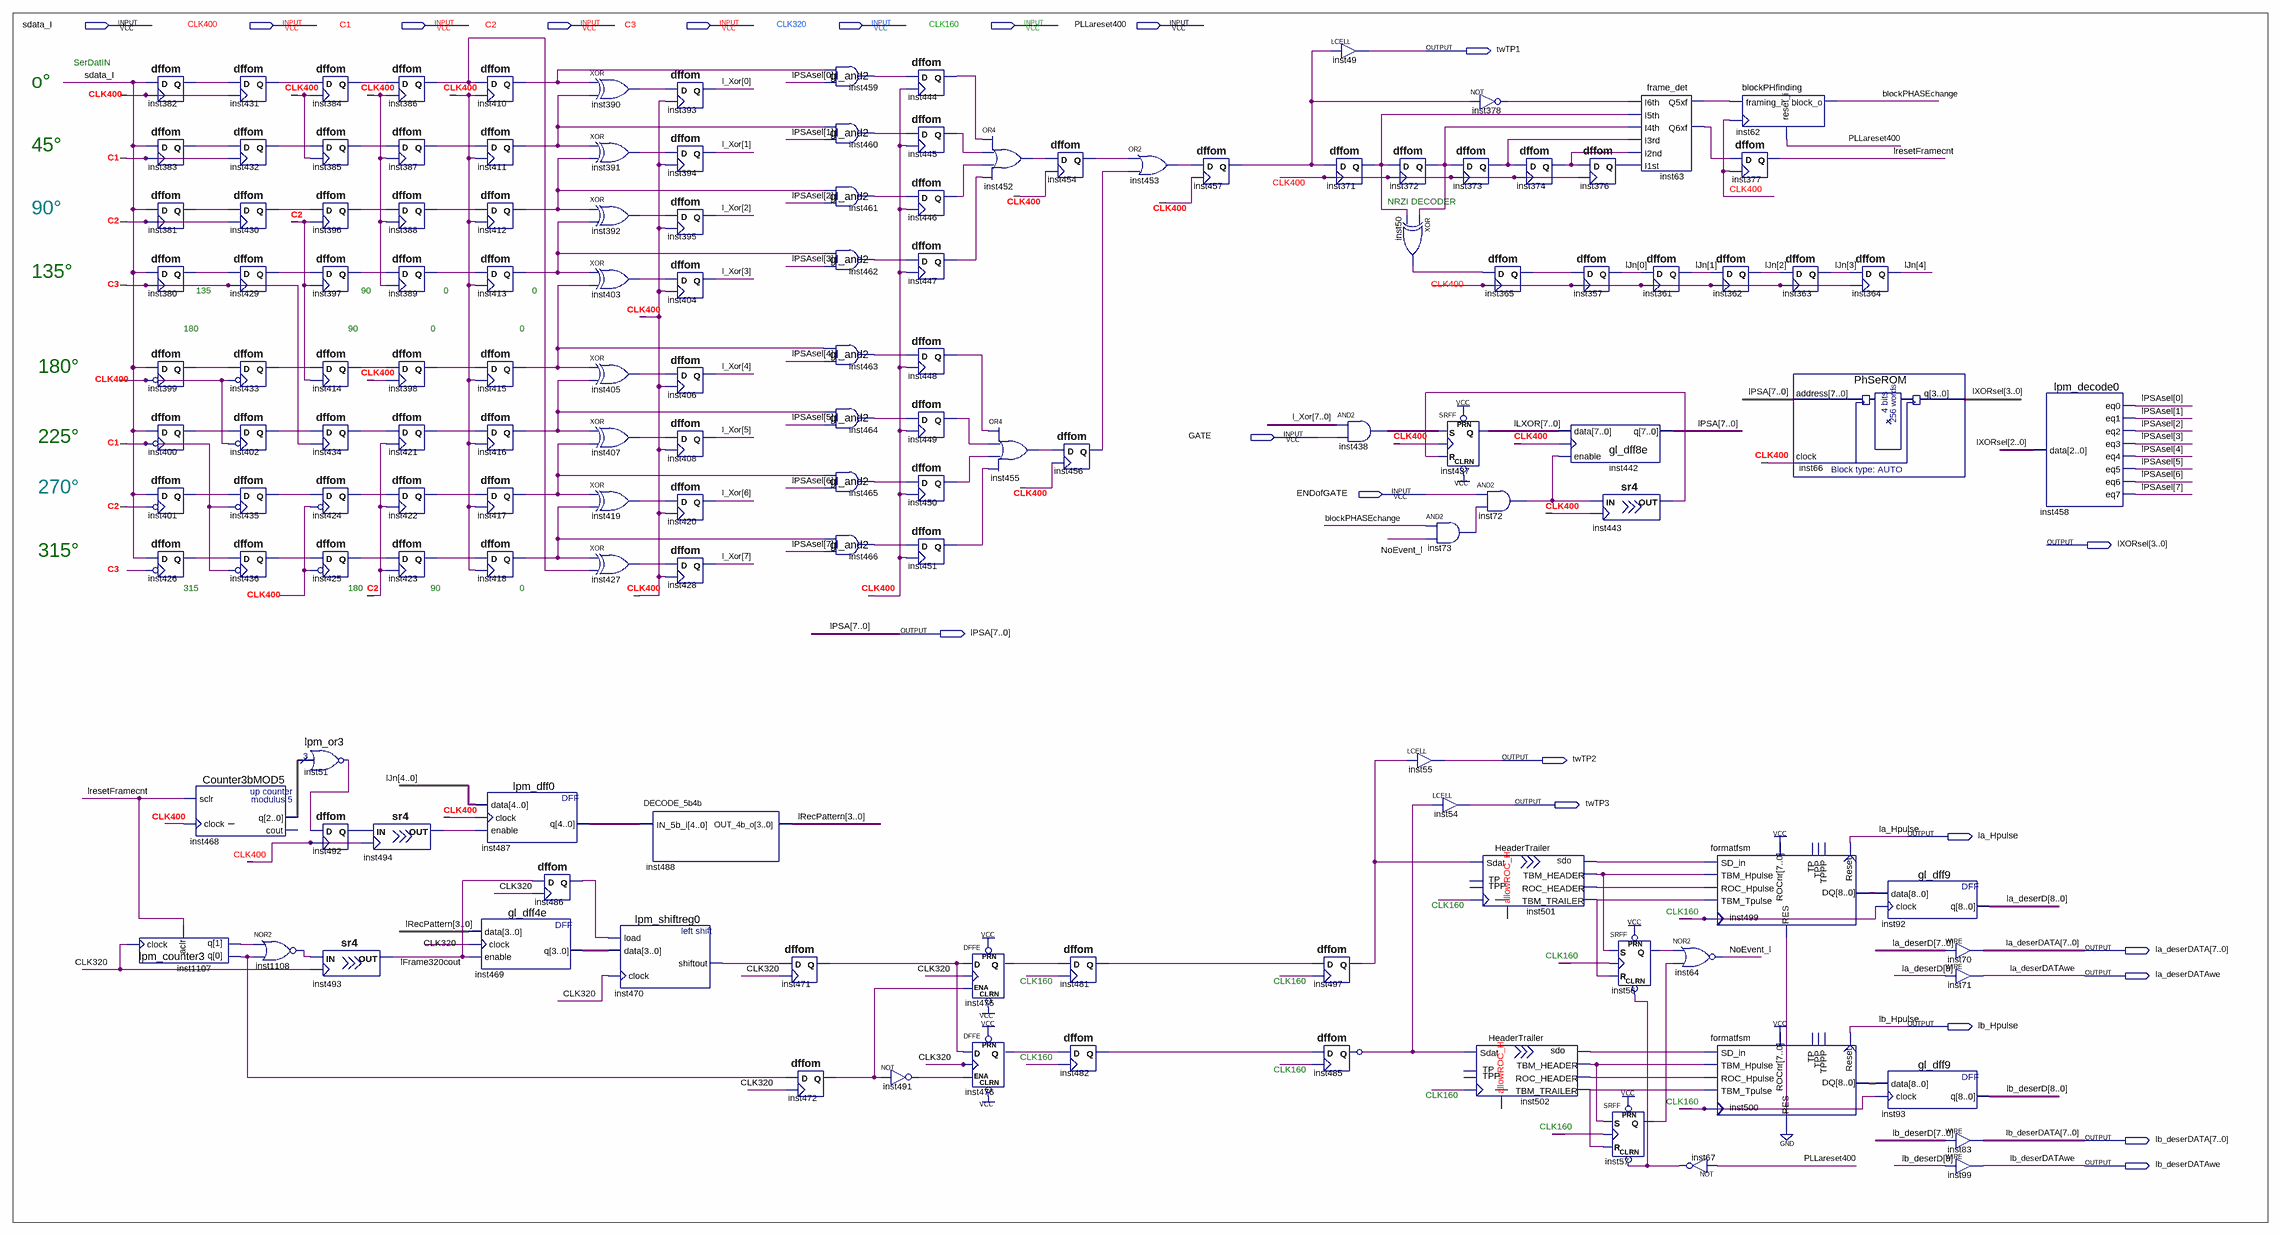
[diagram p0: schematic sheet]
// Quartus schematic deser400old.bdf as structural Verilog: 140 symbols, 21 pins
module deser400old (
  input  sdata_I,
  input  CLK400,
  input  C1,
  input  C2,
  input  C3,
  input  CLK320,
  input  CLK160,
  input  PLLareset400,
  input  GATE,
  input  ENDofGATE,
  output twTP1,
  output [3:0] lXORsel,
  output [7:0] lPSA,
  output twTP2,
  output twTP3,
  output la_Hpulse,
  output [7:0] la_deserDATA,
  output la_deserDATAwe,
  output lb_Hpulse,
  output [7:0] lb_deserDATA,
  output lb_deserDATAwe
);

  wire blockPHASEchange, inst50_out, inst51_result, inst51_result_inverted_out, inst56_q, inst57_q,
       inst63_q5xf, inst63_q6xf, inst67_out, inst72_out, inst73_out, inst365_q, inst371_q, inst372_q,
       inst373_q, inst374_q, inst376_q, inst378_out, inst380_q, inst381_q, inst382_q, inst383_q, inst384_q,
       inst385_q, inst386_q, inst387_q, inst388_q, inst389_q, inst390_out, inst391_out, inst392_out,
       inst396_q, inst397_q, inst398_q, inst399_q, inst400_q, inst401_q, inst402_q, inst403_out, inst405_out,
       inst407_out, inst410_q, inst411_q, inst412_q, inst413_q, inst414_q, inst415_q, inst416_q, inst417_q,
       inst418_q, inst419_out, inst421_q, inst422_q, inst423_q, inst424_q, inst425_q, inst426_q, inst427_out,
       inst429_q, inst430_q, inst431_q, inst432_q, inst433_q, inst434_q, inst435_q, inst436_q, inst443_out,
       inst444_q, inst445_q, inst446_q, inst447_q, inst448_q, inst449_q, inst450_q, inst451_q, inst452_out,
       inst453_out, inst454_q, inst455_out, inst456_q, inst457_q, inst459_result, inst460_result,
       inst461_result, inst462_result, inst463_result, inst464_result, inst465_result, inst466_result,
       inst470_shiftout, inst471_q, inst472_q, inst475_q, inst476_q, inst481_q, inst482_q, inst485_q,
       inst485_Q_inverted_out, inst486_q, inst491_out, inst492_q, inst494_out, inst497_q, inst501_roc_header,
       inst501_sdo, inst501_tbm_header, inst501_tbm_trailer, inst502_roc_header, inst502_sdo,
       inst502_tbm_header, inst502_tbm_trailer, inst1107_q, inst1107_q_2, inst1108_out, lFrame320cout,
       lresetFramecnt, NoEvent_l;
  wire [2:0] inst468_q;
  wire [3:0] inst469_q, lRecPattern;
  wire [4:0] inst487_q, lJn;
  wire [7:0] inst438_out, l_Xor, lLXOR, lPSAsel;
  wire [8:0] inst499_dq, inst500_dq, la_deserD, lb_deserD;

  dffom inst382 (.D(sdata_I), .CK(CLK400), .Q(inst382_q));
  dffom inst383 (.D(sdata_I), .CK(C1), .Q(inst383_q));
  dffom inst381 (.D(sdata_I), .CK(C2), .Q(inst381_q));
  dffom inst380 (.D(sdata_I), .CK(C3), .Q(inst380_q));
  dffom inst399 (.D(sdata_I), .CK(~CLK400), .Q(inst399_q));
  dffom inst400 (.D(sdata_I), .CK(~C1), .Q(inst400_q));
  dffom inst401 (.D(sdata_I), .CK(~C2), .Q(inst401_q));
  dffom inst426 (.D(sdata_I), .CK(~C3), .Q(inst426_q));
  lpm_counter3 inst1107 (.clock(CLK320), .aclr(lresetFramecnt), .q({inst1107_q, inst1107_q_2}));
  Counter3bMOD5 inst468 (.sclr(lresetFramecnt), .clock(CLK400), .q(inst468_q));  // open: cout
  dffom inst431 (.D(inst382_q), .CK(CLK400), .Q(inst431_q));
  dffom inst432 (.D(inst383_q), .CK(C1), .Q(inst432_q));
  dffom inst430 (.D(inst381_q), .CK(C2), .Q(inst430_q));
  dffom inst429 (.D(inst380_q), .CK(C3), .Q(inst429_q));
  dffom inst433 (.D(inst399_q), .CK(~CLK400), .Q(inst433_q));
  dffom inst402 (.D(inst400_q), .CK(~CLK400), .Q(inst402_q));
  dffom inst435 (.D(inst401_q), .CK(~C1), .Q(inst435_q));
  dffom inst436 (.D(inst426_q), .CK(~C1), .Q(inst436_q));
  nor inst1108 (inst1108_out, inst1107_q, inst1107_q_2);
  dffom inst384 (.D(inst431_q), .CK(CLK400), .Q(inst384_q));
  dffom inst385 (.D(inst432_q), .CK(CLK400), .Q(inst385_q));
  dffom inst396 (.D(inst430_q), .CK(C2), .Q(inst396_q));
  dffom inst397 (.D(inst429_q), .CK(C2), .Q(inst397_q));
  dffom inst414 (.D(inst433_q), .CK(C2), .Q(inst414_q));
  dffom inst434 (.D(inst402_q), .CK(C3), .Q(inst434_q));
  dffom inst424 (.D(inst435_q), .CK(~CLK400), .Q(inst424_q));
  dffom inst425 (.D(inst436_q), .CK(~CLK400), .Q(inst425_q));
  lpm_or3 inst51 (.data(inst468_q), .result(inst51_result));
  not inst51_result_inverted (inst51_result_inverted_out, inst51_result);
  dffom inst492 (.D(inst51_result_inverted_out), .CK(CLK400), .Q(inst492_q));
  sr4 inst493 (.IN(inst1108_out), .CLK(CLK320), .OUT(lFrame320cout));
  sr4 inst494 (.IN(inst492_q), .CLK(CLK400), .OUT(inst494_out));
  dffom inst386 (.D(inst384_q), .CK(CLK400), .Q(inst386_q));
  dffom inst387 (.D(inst385_q), .CK(CLK400), .Q(inst387_q));
  dffom inst388 (.D(inst396_q), .CK(CLK400), .Q(inst388_q));
  dffom inst389 (.D(inst397_q), .CK(CLK400), .Q(inst389_q));
  dffom inst398 (.D(inst414_q), .CK(CLK400), .Q(inst398_q));
  dffom inst421 (.D(inst434_q), .CK(C2), .Q(inst421_q));
  dffom inst422 (.D(inst424_q), .CK(C2), .Q(inst422_q));
  dffom inst423 (.D(inst425_q), .CK(C2), .Q(inst423_q));
  dffom inst410 (.D(inst386_q), .CK(CLK400), .Q(inst410_q));
  dffom inst411 (.D(inst387_q), .CK(CLK400), .Q(inst411_q));
  dffom inst412 (.D(inst388_q), .CK(CLK400), .Q(inst412_q));
  dffom inst413 (.D(inst389_q), .CK(CLK400), .Q(inst413_q));
  dffom inst415 (.D(inst398_q), .CK(CLK400), .Q(inst415_q));
  dffom inst416 (.D(inst421_q), .CK(CLK400), .Q(inst416_q));
  dffom inst417 (.D(inst422_q), .CK(CLK400), .Q(inst417_q));
  dffom inst418 (.D(inst423_q), .CK(CLK400), .Q(inst418_q));
  lpm_dff0 inst487 (.data(lJn), .clock(CLK400), .enable(inst494_out), .q(inst487_q));
  gl_dff4e inst469 (.data(lRecPattern), .clock(CLK320), .enable(lFrame320cout), .q(inst469_q));
  dffom inst486 (.D(lFrame320cout), .CK(CLK320), .Q(inst486_q));
  xor inst390 (inst390_out, inst410_q, inst411_q);
  xor inst391 (inst391_out, inst411_q, inst412_q);
  xor inst392 (inst392_out, inst412_q, inst413_q);
  xor inst403 (inst403_out, inst413_q, inst415_q);
  xor inst405 (inst405_out, inst415_q, inst416_q);
  xor inst407 (inst407_out, inst416_q, inst417_q);
  xor inst419 (inst419_out, inst417_q, inst418_q);
  xor inst427 (inst427_out, inst418_q, inst386_q);
  lpm_shiftreg0 inst470 (.load(inst486_q), .data(inst469_q), .clock(CLK320), .shiftout(inst470_shiftout));
  dffom inst393 (.D(inst390_out), .CK(CLK400), .Q(l_Xor[0]));
  dffom inst394 (.D(inst391_out), .CK(CLK400), .Q(l_Xor[1]));
  dffom inst395 (.D(inst392_out), .CK(CLK400), .Q(l_Xor[2]));
  dffom inst404 (.D(inst403_out), .CK(CLK400), .Q(l_Xor[3]));
  dffom inst406 (.D(inst405_out), .CK(CLK400), .Q(l_Xor[4]));
  dffom inst408 (.D(inst407_out), .CK(CLK400), .Q(l_Xor[5]));
  dffom inst420 (.D(inst419_out), .CK(CLK400), .Q(l_Xor[6]));
  dffom inst428 (.D(inst427_out), .CK(CLK400), .Q(l_Xor[7]));
  DECODE_5b4b inst488 (.IN_5b_i(inst487_q), .OUT_4b_o(lRecPattern));
  dffom inst471 (.D(inst470_shiftout), .CK(CLK320), .Q(inst471_q));
  dffom inst472 (.D(inst1107_q_2), .CK(CLK320), .Q(inst472_q));
  gl_and2 inst459 (.data0(inst410_q), .data1(lPSAsel[0]), .result(inst459_result));
  gl_and2 inst460 (.data0(inst411_q), .data1(lPSAsel[1]), .result(inst460_result));
  gl_and2 inst461 (.data0(inst412_q), .data1(lPSAsel[2]), .result(inst461_result));
  gl_and2 inst462 (.data0(inst413_q), .data1(lPSAsel[3]), .result(inst462_result));
  gl_and2 inst463 (.data0(inst415_q), .data1(lPSAsel[4]), .result(inst463_result));
  gl_and2 inst464 (.data0(inst416_q), .data1(lPSAsel[5]), .result(inst464_result));
  gl_and2 inst465 (.data0(inst417_q), .data1(lPSAsel[6]), .result(inst465_result));
  gl_and2 inst466 (.data0(inst418_q), .data1(lPSAsel[7]), .result(inst466_result));
  dffom inst444 (.D(inst459_result), .CK(CLK400), .Q(inst444_q));
  dffom inst445 (.D(inst460_result), .CK(CLK400), .Q(inst445_q));
  dffom inst446 (.D(inst461_result), .CK(CLK400), .Q(inst446_q));
  dffom inst447 (.D(inst462_result), .CK(CLK400), .Q(inst447_q));
  dffom inst448 (.D(inst463_result), .CK(CLK400), .Q(inst448_q));
  dffom inst449 (.D(inst464_result), .CK(CLK400), .Q(inst449_q));
  dffom inst450 (.D(inst465_result), .CK(CLK400), .Q(inst450_q));
  dffom inst451 (.D(inst466_result), .CK(CLK400), .Q(inst451_q));
  not inst491 (inst491_out, inst472_q);
  DFFE inst475 (.PRN(1'b1), .CLRN(1'b1), .D(inst471_q), .CLK(CLK320), .ENA(inst472_q), .Q(inst475_q));
  DFFE inst476 (.PRN(1'b1), .CLRN(1'b1), .D(inst471_q), .CLK(CLK320), .ENA(inst491_out), .Q(inst476_q));
  or inst452 (inst452_out, inst444_q, inst445_q, inst446_q, inst447_q);
  or inst455 (inst455_out, inst448_q, inst449_q, inst450_q, inst451_q);
  dffom inst454 (.D(inst452_out), .CK(CLK400), .Q(inst454_q));
  dffom inst456 (.D(inst455_out), .CK(CLK400), .Q(inst456_q));
  dffom inst481 (.D(inst475_q), .CK(CLK160), .Q(inst481_q));
  dffom inst482 (.D(inst476_q), .CK(CLK160), .Q(inst482_q));
  or inst453 (inst453_out, inst454_q, inst456_q);
  dffom inst457 (.D(inst453_out), .CK(CLK400), .Q(inst457_q));
  dffom inst371 (.D(inst457_q), .CK(CLK400), .Q(inst371_q));
  dffom inst497 (.D(inst481_q), .CK(CLK160), .Q(inst497_q));
  dffom inst485 (.D(inst482_q), .CK(CLK160), .Q(inst485_q));
  not inst485_Q_inverted (inst485_Q_inverted_out, inst485_q);
  LCELL inst49 (.IN(inst457_q), .OUT(twTP1));
  assign inst438_out = l_Xor & {8{GATE}};  // AND2 inst438, 8 bits wide
  dffom inst372 (.D(inst371_q), .CK(CLK400), .Q(inst372_q));
  xor inst50 (inst50_out, inst372_q, inst371_q);
  and inst73 (inst73_out, blockPHASEchange, NoEvent_l);
  LCELL inst55 (.IN(inst497_q), .OUT(twTP2));
  not inst378 (inst378_out, inst457_q);
  dffom inst373 (.D(inst372_q), .CK(CLK400), .Q(inst373_q));
  SRFF inst437[7:0] (.PRN(1'b1), .CLRN(1'b1), .S(inst438_out), .R(inst443_out), .CLK(CLK400), .Q(lLXOR));
  and inst72 (inst72_out, ENDofGATE, inst73_out);
  LCELL inst54 (.IN(inst485_Q_inverted_out), .OUT(twTP3));
  HeaderTrailer inst501 (
    .Sdat(inst497_q), .CLK(CLK160), .TBM_HEADER(inst501_tbm_header), .ROC_HEADER(inst501_roc_header),
    .TBM_TRAILER(inst501_tbm_trailer), .sdo(inst501_sdo));  // open: allowROC_H, TP, TPP
  HeaderTrailer inst502 (
    .Sdat(inst485_Q_inverted_out), .CLK(CLK160), .TBM_HEADER(inst502_tbm_header),
    .ROC_HEADER(inst502_roc_header), .TBM_TRAILER(inst502_tbm_trailer), .sdo(inst502_sdo));  // open: allowROC_H, TP, TPP
  dffom inst374 (.D(inst373_q), .CK(CLK400), .Q(inst374_q));
  dffom inst365 (.D(inst50_out), .CK(CLK400), .Q(inst365_q));
  dffom inst376 (.D(inst374_q), .CK(CLK400), .Q(inst376_q));
  dffom inst357 (.D(inst365_q), .CK(CLK400), .Q(lJn[0]));
  gl_dff8e inst442 (.data(lLXOR), .enable(inst72_out), .clock(CLK400), .q(lPSA));
  frame_det inst63 (
    .I1st(inst376_q), .I2nd(inst374_q), .I3rd(inst373_q), .I4th(inst372_q), .I5th(inst371_q),
    .I6th(inst378_out), .Q5xf(inst63_q5xf), .Q6xf(inst63_q6xf));
  sr4 inst443 (.IN(inst72_out), .CLK(CLK400), .OUT(inst443_out));
  SRFF inst56 (
    .PRN(1'b1), .CLRN(inst67_out), .S(inst501_tbm_header), .R(inst501_tbm_trailer), .CLK(CLK160), .Q(inst56_q));
  SRFF inst57 (
    .PRN(1'b1), .CLRN(inst67_out), .S(inst502_tbm_header), .R(inst502_tbm_trailer), .CLK(CLK160), .Q(inst57_q));
  dffom inst361 (.D(lJn[0]), .CK(CLK400), .Q(lJn[1]));
  nor inst64 (NoEvent_l, inst56_q, inst57_q);
  not inst67 (inst67_out, PLLareset400);
  blockPHfinding inst62 (.reset_i(PLLareset400), .framing_i(inst63_q5xf), .clk_i(CLK400), .block_o(blockPHASEchange));
  dffom inst377 (.D(inst63_q6xf), .CK(CLK400), .Q(lresetFramecnt));
  dffom inst362 (.D(lJn[1]), .CK(CLK400), .Q(lJn[2]));
  formatfsm inst499 (
    .TBM_Hpulse(inst501_tbm_header), .ROC_Hpulse(inst501_roc_header), .TBM_Tpulse(inst501_tbm_trailer),
    .SD_in(inst501_sdo), .RES(1'b0), .ROCnr({8{1'b1}}), .CLK160(CLK160), .DQ(inst499_dq), .Reset(la_Hpulse));  // open: TPPP, TPP, TP
  formatfsm inst500 (
    .TBM_Hpulse(inst502_tbm_header), .ROC_Hpulse(inst502_roc_header), .TBM_Tpulse(inst502_tbm_trailer),
    .SD_in(inst502_sdo), .RES(1'b0), .ROCnr({8{1'b1}}), .CLK160(CLK160), .DQ(inst500_dq), .Reset(lb_Hpulse));  // open: TPPP, TPP, TP
  dffom inst363 (.D(lJn[2]), .CK(CLK400), .Q(lJn[3]));
  PhSeROM inst66 (.address(lPSA), .clock(CLK400), .q(lXORsel));
  dffom inst364 (.D(lJn[3]), .CK(CLK400), .Q(lJn[4]));
  gl_dff9 inst92 (.clock(CLK160), .data(inst499_dq), .q(la_deserD));
  gl_dff9 inst93 (.data(inst500_dq), .clock(CLK160), .q(lb_deserD));
  assign la_deserDATA = la_deserD[7:0];  // WIRE inst70
  assign la_deserDATAwe = la_deserD[8];  // WIRE inst71
  assign lb_deserDATA = lb_deserD[7:0];  // WIRE inst83
  assign lb_deserDATAwe = lb_deserD[8];  // WIRE inst99
  lpm_decode0 inst458 (
    .data(lXORsel[2:0]), .eq0(lPSAsel[0]), .eq1(lPSAsel[1]), .eq2(lPSAsel[2]), .eq3(lPSAsel[3]),
    .eq4(lPSAsel[4]), .eq5(lPSAsel[5]), .eq6(lPSAsel[6]), .eq7(lPSAsel[7]));

  // Notes on the sheet:
  //   SerDatIN
  //   o°
  //   -
  //   45°
  //   90°
  //   NRZI DECODER
  //   135°
  //   135
  //   90
  //   0
  //   0
  //   180
  //   90
  //   0
  //   0
  //   180°
  //   -
  //   225°
  //   270°
  //   315°
  //   315
  //   180
  //   90
  //   0
endmodule
